# EAGLE schematic pcbqr (EAGLE 5.11)

## Sheet 1 of 3
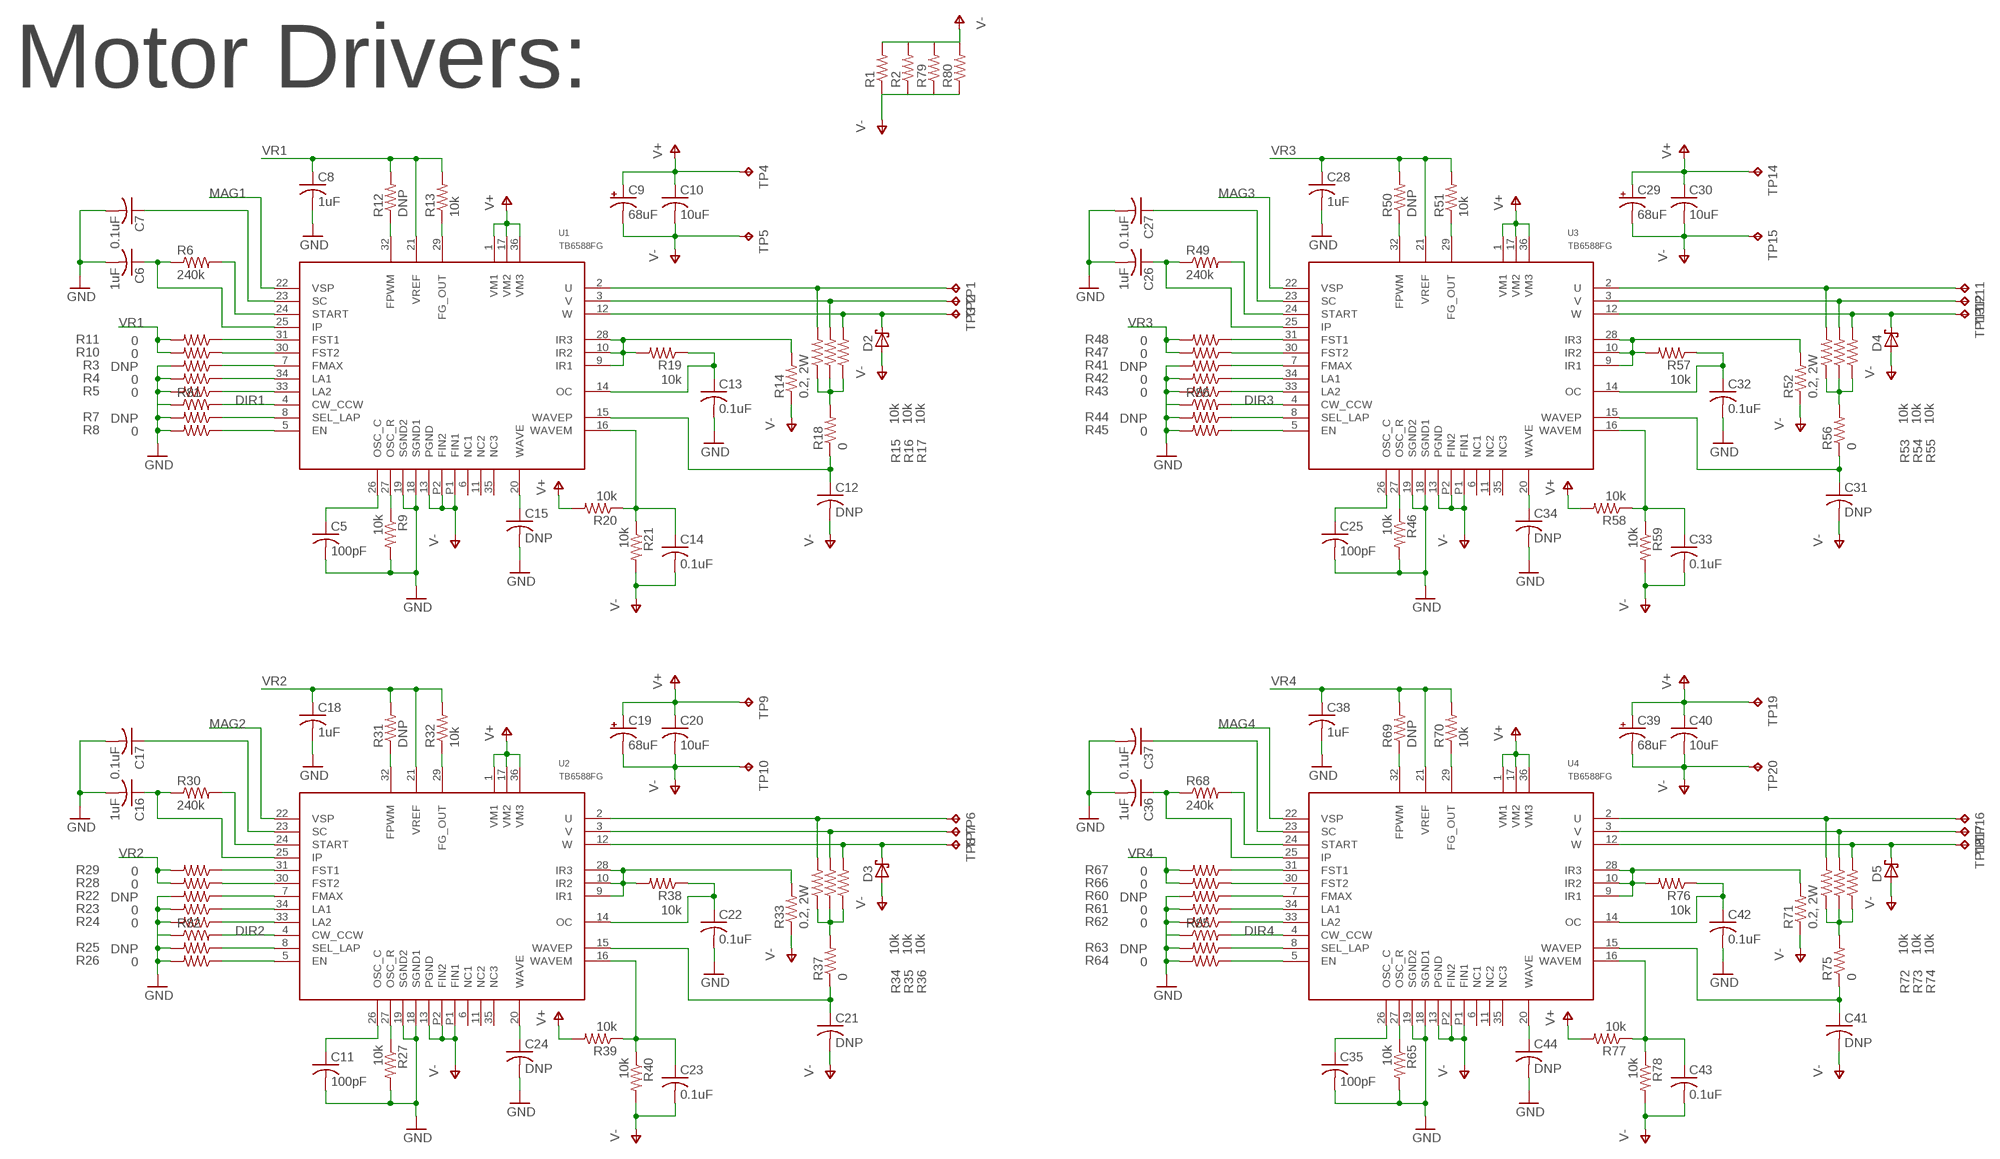
[diagram p0: schematic, sheet 1]

### Parts
C5  100pF  C-USC0603  [C0603]
C6  1uF  C-USC0603  [C0603]
C7  0.1uF  C-USC0603  [C0603]
C8  1uF  C-USC0603  [C0603]
C9  68uF  CPOL-USD  [PANASONIC_D]
C10  10uF  C-USC1206  [C1206]
C11  100pF  C-USC0603  [C0603]
C12  DNP  C-USC0603  [C0603]
C13  0.1uF  C-USC0603  [C0603]
C14  0.1uF  C-USC0603  [C0603]
C15  DNP  C-USC0603  [C0603]
C16  1uF  C-USC0603  [C0603]
C17  0.1uF  C-USC0603  [C0603]
C18  1uF  C-USC0603  [C0603]
C19  68uF  CPOL-USD  [PANASONIC_D]
C20  10uF  C-USC1206  [C1206]
C21  DNP  C-USC0603  [C0603]
C22  0.1uF  C-USC0603  [C0603]
C23  0.1uF  C-USC0603  [C0603]
C24  DNP  C-USC0603  [C0603]
C25  100pF  C-USC0603  [C0603]
C26  1uF  C-USC0603  [C0603]
C27  0.1uF  C-USC0603  [C0603]
C28  1uF  C-USC0603  [C0603]
C29  68uF  CPOL-USD  [PANASONIC_D]
C30  10uF  C-USC1206  [C1206]
C31  DNP  C-USC0603  [C0603]
C32  0.1uF  C-USC0603  [C0603]
C33  0.1uF  C-USC0603  [C0603]
C34  DNP  C-USC0603  [C0603]
C35  100pF  C-USC0603  [C0603]
C36  1uF  C-USC0603  [C0603]
C37  0.1uF  C-USC0603  [C0603]
C38  1uF  C-USC0603  [C0603]
C39  68uF  CPOL-USD  [PANASONIC_D]
C40  10uF  C-USC1206  [C1206]
C41  DNP  C-USC0603  [C0603]
C42  0.1uF  C-USC0603  [C0603]
C43  0.1uF  C-USC0603  [C0603]
C44  DNP  C-USC0603  [C0603]
D2  SCHOTTKY_SMA  [SMA]
D3  SCHOTTKY_SMA  [SMA]
D4  SCHOTTKY_SMA  [SMA]
D5  SCHOTTKY_SMA  [SMA]
R1  R-US_M1206  [M1206]
R2  R-US_M1206  [M1206]
R3  DNP  R-US_R0603  [R0603]
R4  0  R-US_R0603  [R0603]
R5  0  R-US_R0603  [R0603]
R6  240k  R-US_R0603  [R0603]
R7  DNP  R-US_R0603  [R0603]
R8  0  R-US_R0603  [R0603]
R9  10k  R-US_R0603  [R0603]
R10  0  R-US_R0603  [R0603]
R11  0  R-US_R0603  [R0603]
R12  DNP  R-US_R0603  [R0603]
R13  10k  R-US_R0603  [R0603]
R14  0.2, 2W  R-US_R2512  [R2512]
R15  10k  R-US_R0603  [R0603]
R16  10k  R-US_R0603  [R0603]
R17  10k  R-US_R0603  [R0603]
R18  0  R-US_R0603  [R0603]
R19  10k  R-US_R0603  [R0603]
R20  10k  R-US_R0603  [R0603]
R21  10k  R-US_R0603  [R0603]
R22  DNP  R-US_R0603  [R0603]
R23  0  R-US_R0603  [R0603]
R24  0  R-US_R0603  [R0603]
R25  DNP  R-US_R0603  [R0603]
R26  0  R-US_R0603  [R0603]
R27  10k  R-US_R0603  [R0603]
R28  0  R-US_R0603  [R0603]
R29  0  R-US_R0603  [R0603]
R30  240k  R-US_R0603  [R0603]
R31  DNP  R-US_R0603  [R0603]
R32  10k  R-US_R0603  [R0603]
R33  0.2, 2W  R-US_R2512  [R2512]
R34  10k  R-US_R0603  [R0603]
R35  10k  R-US_R0603  [R0603]
R36  10k  R-US_R0603  [R0603]
R37  0  R-US_R0603  [R0603]
R38  10k  R-US_R0603  [R0603]
R39  10k  R-US_R0603  [R0603]
R40  10k  R-US_R0603  [R0603]
R41  DNP  R-US_R0603  [R0603]
R42  0  R-US_R0603  [R0603]
R43  0  R-US_R0603  [R0603]
R44  DNP  R-US_R0603  [R0603]
R45  0  R-US_R0603  [R0603]
R46  10k  R-US_R0603  [R0603]
R47  0  R-US_R0603  [R0603]
R48  0  R-US_R0603  [R0603]
R49  240k  R-US_R0603  [R0603]
R50  DNP  R-US_R0603  [R0603]
R51  10k  R-US_R0603  [R0603]
R52  0.2, 2W  R-US_R2512  [R2512]
R53  10k  R-US_R0603  [R0603]
R54  10k  R-US_R0603  [R0603]
R55  10k  R-US_R0603  [R0603]
R56  0  R-US_R0603  [R0603]
R57  10k  R-US_R0603  [R0603]
R58  10k  R-US_R0603  [R0603]
R59  10k  R-US_R0603  [R0603]
R60  DNP  R-US_R0603  [R0603]
R61  0  R-US_R0603  [R0603]
R62  0  R-US_R0603  [R0603]
R63  DNP  R-US_R0603  [R0603]
R64  0  R-US_R0603  [R0603]
R65  10k  R-US_R0603  [R0603]
R66  0  R-US_R0603  [R0603]
R67  0  R-US_R0603  [R0603]
R68  240k  R-US_R0603  [R0603]
R69  DNP  R-US_R0603  [R0603]
R70  10k  R-US_R0603  [R0603]
R71  0.2, 2W  R-US_R2512  [R2512]
R72  10k  R-US_R0603  [R0603]
R73  10k  R-US_R0603  [R0603]
R74  10k  R-US_R0603  [R0603]
R75  0  R-US_R0603  [R0603]
R76  10k  R-US_R0603  [R0603]
R77  10k  R-US_R0603  [R0603]
R78  10k  R-US_R0603  [R0603]
R79  R-US_M1206  [M1206]
R80  R-US_M1206  [M1206]
R81  R-US_R0402  [R0402]
R82  R-US_R0402  [R0402]
R85  R-US_R0402  [R0402]
R86  R-US_R0402  [R0402]
TP1  TPTP20SQ  [TP20SQ]
TP2  TPTP20SQ  [TP20SQ]
TP3  TPTP20SQ  [TP20SQ]
TP4  TPTP20SQ  [TP20SQ]
TP5  TPTP20SQ  [TP20SQ]
TP6  TPTP20SQ  [TP20SQ]
TP7  TPTP20SQ  [TP20SQ]
TP8  TPTP20SQ  [TP20SQ]
TP9  TPTP20SQ  [TP20SQ]
TP10  TPTP20SQ  [TP20SQ]
TP11  TPTP20SQ  [TP20SQ]
TP12  TPTP20SQ  [TP20SQ]
TP13  TPTP20SQ  [TP20SQ]
TP14  TPTP20SQ  [TP20SQ]
TP15  TPTP20SQ  [TP20SQ]
TP16  TPTP20SQ  [TP20SQ]
TP17  TPTP20SQ  [TP20SQ]
TP18  TPTP20SQ  [TP20SQ]
TP19  TPTP20SQ  [TP20SQ]
TP20  TPTP20SQ  [TP20SQ]
U1  TB6588FG  [HSOP36-P-450-0.65]
U2  TB6588FG  [HSOP36-P-450-0.65]
U3  TB6588FG  [HSOP36-P-450-0.65]
U4  TB6588FG  [HSOP36-P-450-0.65]

### Nets
DIR1: R81.2 U1.4(CW_CCW)
DIR2: R82.2 U2.4(CW_CCW)
DIR3: R86.2 U3.4(CW_CCW)
DIR4: R85.2 U4.4(CW_CCW)
GND: C5.2 C6.2 C7.2 C8.2 C11.2 C13.2 C15.2 C16.2 C17.2 C18.2 C22.2 C24.2 C25.2 C26.2 C27.2 C28.2 C32.2 C34.2 C35.2 C36.2 C37.2 C38.2 C42.2 C44.2 R3.2 R4.2 R5.2 R7.2 R8.2 R9.2 R22.2 R23.2 R24.2 R25.2 R26.2 R27.2 R41.2 R42.2 R43.2 R44.2 R45.2 R46.2 R60.2 R61.2 R62.2 R63.2 R64.2 R65.2 R81.1 R82.1 R85.1 R86.1 U1.18(SGND1) U1.19(SGND2) U2.18(SGND1) U2.19(SGND2) U3.18(SGND1) U3.19(SGND2) U4.18(SGND1) U4.19(SGND2) ; also sheet 2,3
MAG1: U1.22(VSP) ; also sheet 2
MAG2: U2.22(VSP) ; also sheet 2
MAG3: U3.22(VSP) ; also sheet 2
MAG4: U4.22(VSP) ; also sheet 2
N$3: R15.1 R16.1 R17.1 R18.2
N$4: R14.2 R19.2 U1.9(IR1) U1.10(IR2) U1.28(IR3)
N$5: R15.2 TP1.TP U1.2(U)
N$6: R16.2 TP2.TP U1.3(V)
N$7: D2.C R17.2 TP3.TP U1.12(W)
N$8: R8.1 U1.5(EN)
N$9: R7.1 U1.8(SEL_LAP)
N$10: R6.2 U1.24(START)
N$11: R5.1 U1.33(LA2)
N$12: R4.1 U1.34(LA1)
N$13: R3.1 U1.7(FMAX)
N$14: C5.1 U1.26(OSC_C)
N$15: R9.1 U1.27(OSC_R)
N$16: R10.1 U1.30(FST2)
N$17: R11.1 U1.31(FST1)
N$18: C6.1 R6.1 U1.25(IP)
N$19: R12.1 U1.32(FPWM)
N$20: C7.1 U1.23(SC)
N$21: R13.1 U1.29(FG_OUT)
N$22: C14.1 R20.1 R21.1 U1.16(WAVEM)
N$23: R33.2 R38.2 U2.9(IR1) U2.10(IR2) U2.28(IR3)
N$24: C12.1 R18.1 U1.15(WAVEP)
N$25: C13.1 R19.1 U1.14(OC)
N$26: C15.1 U1.20(WAVE)
N$27: R34.2 TP6.TP U2.2(U)
N$28: R35.2 TP7.TP U2.3(V)
N$29: D3.C R36.2 TP8.TP U2.12(W)
N$30: R26.1 U2.5(EN)
N$31: R25.1 U2.8(SEL_LAP)
N$32: R24.1 U2.33(LA2)
N$33: R23.1 U2.34(LA1)
N$34: R22.1 U2.7(FMAX)
N$35: C11.1 U2.26(OSC_C)
N$36: R27.1 U2.27(OSC_R)
N$37: R28.1 U2.30(FST2)
N$38: R29.1 U2.31(FST1)
N$39: R30.2 U2.24(START)
N$40: C16.1 R30.1 U2.25(IP)
N$41: C17.1 U2.23(SC)
N$42: R31.1 U2.32(FPWM)
N$43: R32.1 U2.29(FG_OUT)
N$44: R34.1 R35.1 R36.1 R37.2
N$45: C21.1 R37.1 U2.15(WAVEP)
N$46: C22.1 R38.1 U2.14(OC)
N$47: C23.1 R39.1 R40.1 U2.16(WAVEM)
N$48: C24.1 U2.20(WAVE)
N$49: R52.2 R57.2 U3.9(IR1) U3.10(IR2) U3.28(IR3)
N$50: R53.2 TP11.TP U3.2(U)
N$51: R54.2 TP12.TP U3.3(V)
N$52: D4.C R55.2 TP13.TP U3.12(W)
N$53: R45.1 U3.5(EN)
N$54: R44.1 U3.8(SEL_LAP)
N$55: R43.1 U3.33(LA2)
N$56: R42.1 U3.34(LA1)
N$57: R41.1 U3.7(FMAX)
N$58: C25.1 U3.26(OSC_C)
N$59: R46.1 U3.27(OSC_R)
N$60: R47.1 U3.30(FST2)
N$61: R48.1 U3.31(FST1)
N$62: R49.2 U3.24(START)
N$63: C26.1 R49.1 U3.25(IP)
N$64: C27.1 U3.23(SC)
N$65: R50.1 U3.32(FPWM)
N$66: R51.1 U3.29(FG_OUT)
N$67: R53.1 R54.1 R55.1 R56.2
N$68: C31.1 R56.1 U3.15(WAVEP)
N$69: C32.1 R57.1 U3.14(OC)
N$70: C33.1 R58.1 R59.1 U3.16(WAVEM)
N$71: C34.1 U3.20(WAVE)
N$72: R71.2 R76.2 U4.9(IR1) U4.10(IR2) U4.28(IR3)
N$73: R72.2 TP16.TP U4.2(U)
N$74: R73.2 TP17.TP U4.3(V)
N$75: D5.C R74.2 TP18.TP U4.12(W)
N$76: R64.1 U4.5(EN)
N$77: R63.1 U4.8(SEL_LAP)
N$78: R62.1 U4.33(LA2)
N$79: R61.1 U4.34(LA1)
N$80: R60.1 U4.7(FMAX)
N$81: C35.1 U4.26(OSC_C)
N$82: R65.1 U4.27(OSC_R)
N$83: R66.1 U4.30(FST2)
N$84: R67.1 U4.31(FST1)
N$85: R68.2 U4.24(START)
N$86: C36.1 R68.1 U4.25(IP)
N$87: C37.1 U4.23(SC)
N$88: R69.1 U4.32(FPWM)
N$89: R70.1 U4.29(FG_OUT)
N$90: R72.1 R73.1 R74.1 R75.2
N$91: C41.1 R75.1 U4.15(WAVEP)
N$92: C42.1 R76.1 U4.14(OC)
N$93: C43.1 R77.1 R78.1 U4.16(WAVEM)
N$94: C44.1 U4.20(WAVE)
V+: C9.+ C10.1 C19.+ C20.1 C29.+ C30.1 C39.+ C40.1 R20.2 R39.2 R58.2 R77.2 TP4.TP TP9.TP TP14.TP TP19.TP U1.1(VM1) U1.17(VM2) U1.36(VM3) U2.1(VM1) U2.17(VM2) U2.36(VM3) U3.1(VM1) U3.17(VM2) U3.36(VM3) U4.1(VM1) U4.17(VM2) U4.36(VM3) ; also sheet 2
V-: C9.- C10.2 C12.2 C14.2 C19.- C20.2 C21.2 C23.2 C29.- C30.2 C31.2 C33.2 C39.- C40.2 C41.2 C43.2 D2.A D3.A D4.A D5.A R1.1 R1.2 R2.1 R2.2 R14.1 R21.2 R33.1 R40.2 R52.1 R59.2 R71.1 R78.2 R79.1 R79.2 R80.1 R80.2 TP5.TP TP10.TP TP15.TP TP20.TP U1.13(PGND) U1.P1(FIN1) U1.P2(FIN2) U2.13(PGND) U2.P1(FIN1) U2.P2(FIN2) U3.13(PGND) U3.P1(FIN1) U3.P2(FIN2) U4.13(PGND) U4.P1(FIN1) U4.P2(FIN2) ; also sheet 2
VR1: C8.1 R10.2 R11.2 R12.2 R13.2 U1.21(VREF)
VR2: C18.1 R28.2 R29.2 R31.2 R32.2 U2.21(VREF)
VR3: C28.1 R47.2 R48.2 R50.2 R51.2 U3.21(VREF)
VR4: C38.1 R66.2 R67.2 R69.2 R70.2 U4.21(VREF)
Unconnected: U1.6(NC1) U1.11(NC2) U1.35(NC3) U2.6(NC1) U2.11(NC2) U2.35(NC3) U3.6(NC1) U3.11(NC2) U3.35(NC3) U4.6(NC1) U4.11(NC2) U4.35(NC3)

### Notes on the sheet
- Motor Drivers:

## Sheet 2 of 3
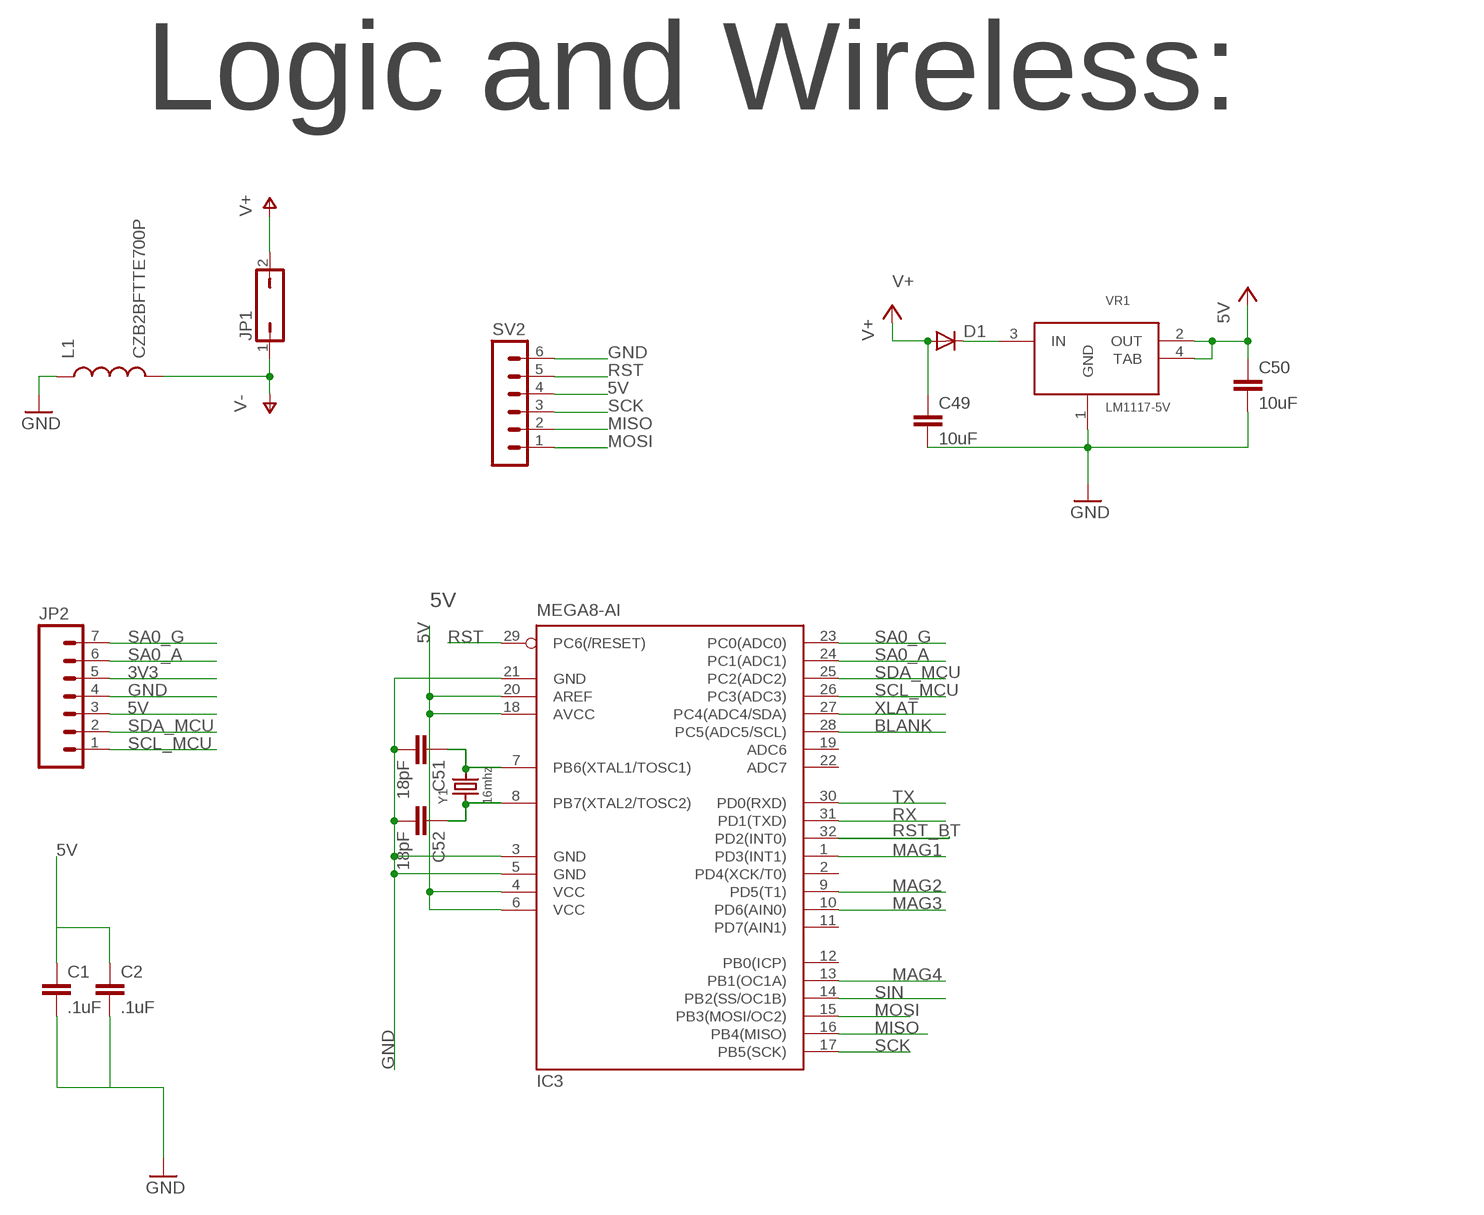
[diagram p1: schematic, sheet 2]

### Parts
C1  .1uF  CAP0805  [0805]
C2  .1uF  CAP0805  [0805]
C49  10uF  CAP0805  [0805]
C50  10uF  CAP0805  [0805]
C51  18pF  CAP0805  [0805]
C52  18pF  CAP0805  [0805]
D1  SPARKFUN_DIODESMA  [SPARKFUN_SMA-DIODE]
IC3  MEGA8-AI  [TQFP32-08]
JP1  JP1Q  [JP1]
JP2  M07  [1X07]
L1  CZB2BFTTE700P  INDUCTOR1206H*  [INDUCTOR-1206]
SV2  MA06-1  [MA06-1]
VR1  LM1117-5V  LM1117  [SOT-223]
Y1  16mhz  CRYSTALTHIN  [CRYSTAL_3.2X2.5]

### Nets
3V3 [power]: JP2.5 ; also sheet 3
5V [power]: C1.1 C2.1 C50.1 IC3.4(VCC) IC3.6(VCC) IC3.18(AVCC) IC3.20(AREF) JP2.3 SV2.4 VR1.2(OUT) VR1.4(TAB)
BLANK: IC3.28(PC5(ADC5/SCL))
GND: C1.2 C2.2 C49.2 C50.2 C51.2 C52.2 IC3.3(GND) IC3.5(GND) IC3.21(GND) JP2.4 L1.P$1 SV2.6 VR1.1(GND) ; also sheet 1,3
MAG1: IC3.1(PD3(INT1)) ; also sheet 1
MAG2: IC3.9(PD5(T1)) ; also sheet 1
MAG3: IC3.10(PD6(AIN0)) ; also sheet 1
MAG4: IC3.13(PB1(OC1A)) ; also sheet 1
MISO: IC3.16(PB4(MISO)) SV2.2
MOSI: IC3.15(PB3(MOSI/OC2)) SV2.1
N$1: D1.C VR1.3(IN)
N$2: C51.1 IC3.7(PB6(XTAL1/TOSC1)) Y1.2
N$95: C52.1 IC3.8(PB7(XTAL2/TOSC2)) Y1.1
RST: IC3.29(PC6(/RESET)) SV2.5
RST_BT: IC3.32(PD2(INT0)) ; also sheet 3
RX: IC3.31(PD1(TXD)) ; also sheet 3
SA0_A: JP2.6
SA0_G: JP2.7
SCK: IC3.17(PB5(SCK)) SV2.3
SCL_MCU: JP2.1
SDA_MCU: JP2.2
SIN: IC3.14(PB2(SS/OC1B))
TX: IC3.30(PD0(RXD)) ; also sheet 3
V+: C49.1 D1.A JP1.2 ; also sheet 1
V-: JP1.1 L1.P$2 ; also sheet 1
XLAT: IC3.27(PC4(ADC4/SDA))
Unconnected: IC3.2(PD4(XCK/T0)) IC3.11(PD7(AIN1)) IC3.12(PB0(ICP)) IC3.19(ADC6) IC3.22(ADC7) IC3.23(PC0(ADC0)) IC3.24(PC1(ADC1)) IC3.25(PC2(ADC2)) IC3.26(PC3(ADC3))

### Notes on the sheet
- Logic and Wireless:

## Sheet 3 of 3
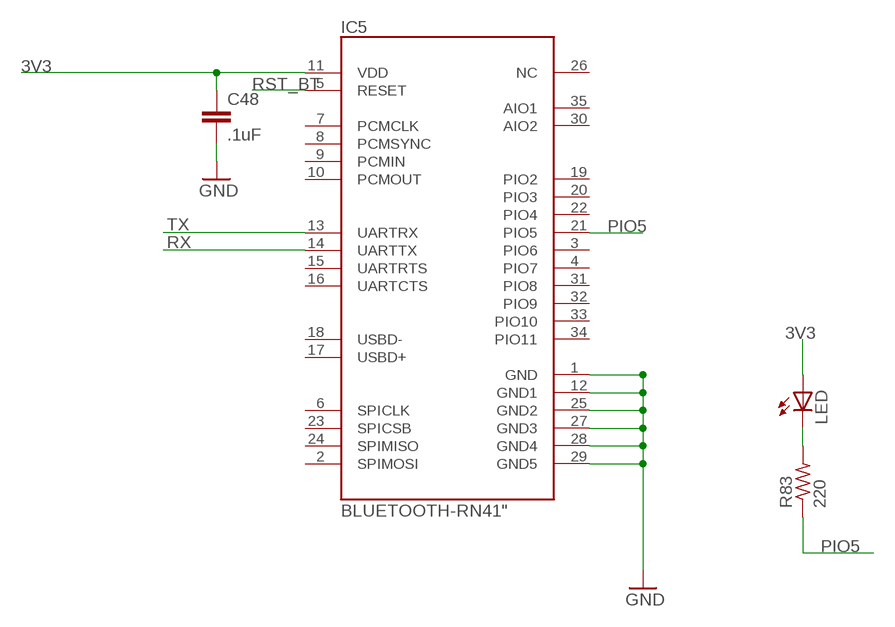
[diagram p2: schematic, sheet 3]

### Parts
C48  .1uF  CAP0805  [0805]
IC5  BLUETOOTH-RN41"  [RN41]
LED  LEDCHIP-LED0603  [CHIP-LED0603]
R83  220  R-US_M0805  [M0805]

### Nets
3V3 [power]: C48.1 IC5.11(VDD) LED.A ; also sheet 2
GND: C48.2 IC5.1(GND) IC5.12(GND1) IC5.25(GND2) IC5.27(GND3) IC5.28(GND4) IC5.29(GND5) ; also sheet 1,2
N$96: LED.C R83.2
PIO5: IC5.21(PIO5) R83.1
RST_BT: IC5.5(RESET) ; also sheet 2
RX: IC5.14(UARTTX) ; also sheet 2
TX: IC5.13(UARTRX) ; also sheet 2
Unconnected: IC5.2(SPIMOSI) IC5.3(PIO6) IC5.4(PIO7) IC5.6(SPICLK) IC5.7(PCMCLK) IC5.8(PCMSYNC) IC5.9(PCMIN) IC5.10(PCMOUT) IC5.15(UARTRTS) IC5.16(UARTCTS) IC5.17(USBD+) IC5.18(USBD-) IC5.19(PIO2) IC5.20(PIO3) IC5.22(PIO4) IC5.23(SPICSB) IC5.24(SPIMISO) IC5.26(NC) IC5.30(AIO2) IC5.31(PIO8) IC5.32(PIO9) IC5.33(PIO10) IC5.34(PIO11) IC5.35(AIO1)

## Library data of the parts
C1 C2 C51 C52 = slice_noshift:CAP: Capacitor Standard 0603 ceramic capacitor, and 0.1" leaded capacitor.
C5-C8 C10-C18 C20-C28 C30-C38 C40-C44 = rcl:C-US: CAPACITOR, American symbol
C9 C19 C29 C39 = rcl:CPOL-US: POLARIZED CAPACITOR, American symbol
C48-C50 = SparkFun:CAP: Capacitor Standard 0603 ceramic capacitor, and 0.1" leaded capacitor.
D1 = avrcanbus:SPARKFUN_DIODE: Diode These are standard reverse protection diodes and small signal diodes. SMA package can handle up to about 1A. SOD-323 can handle about 200mA. What the SOD-323 package when ordering, there are some mfgs out there that are 5-pin packages.
D2-D5 = sc_usercreated:SCHOTTKY_SMA
IC3 = atmel:MEGA8: MICROCONTROLLER 8 Kbytes FLASH, 1 kbytes SRAM, 512 bytes EEPROM, USART, 6-channel 10 bit ADC, 2-channel 8 bit ADC Pin compatible with Atmega48, ATMega88, ATMega168 Source: avr.lbr; MPN: ATMEGA8-16AU; OC_FARNELL: 9171371; OC_NEWARK: 73M8863
IC5 = NSL_Mini_Quad:BLUETOOTH-RN41
JP1 = jumper:JP1Q: JUMPER
JP2 = SparkFun:M07: Header 7 Standard 7-pin 0.1" header. Use with straight break away headers (SKU : PRT-00116), right angle break away headers (PRT-00553), swiss pins (PRT-00743), machine pins (PRT-00117), and female headers (PRT-00115). NOTES ON THE VARIANTS LOCK and LOCK_LONGPADS... This footprint was designed to help hold the alignment of a through-hole component (i.e. 7-pin header) while soldering it into place. You may notice that each hole has been shifted either up or down by 0.005 of an inch from it's more standard position (which is usually a perfectly straight line). This slight alteration caused the pins (the squares in the middle) to touch the edges of the holes. Because they are alternating, it causes a "brace" to hold the header in place. 0.005 has proven to be the perfect amount of "off-center" position when using our standard breakaway headers. Although looks a little odd when you look at the bare footprint, once you have a header in there, the alteration is very hard to notice. Also, if you push a header all the way into place, it is covered up entirely on the bottom side. This idea of altering the position of holes to aid alignment will be further integrated into the Sparkfun Library for other footprints. It can help hold any component with 3 or more connection pins.
L1 = SparkFun:INDUCTOR: Inductors Basic Inductor/Choke - 0603 and 1206. Footprints are not proven and vary greatly between part numbers.
LED = led:LED: LED OSRAM: - CHIPLED LG R971, LG N971, LY N971, LG Q971, LY Q971, LO R971, LY R971 LH N974, LH R974 LS Q976, LO Q976, LY Q976 LO Q996 - Hyper CHIPLED LW Q18S LB Q993, LB Q99A, LB R99A - SideLED LS A670, LO A670, LY A670, LG A670, LP A670 LB A673, LV A673, LT A673, LW A673 LH A674 LY A675 LS A676, LA A676, LO A676, LY A676, LW A676 LS A679, LY A679, LG A679 - Hyper Micro SIDELED® LS Y876, LA Y876, LO Y876, LY Y876 LT Y87S - SmartLED LW L88C, LW L88S LB L89C, LB L89S, LG L890 LS L89K, LO L89K, LY L89K LS L896, LA L896, LO L896, LY L896 - TOPLED LS T670, LO T670, LY T670, LG T670, LP T670 LSG T670, LSP T670, LSY T670, LOP T670, LYG T670 LG T671, LOG T671, LSG T671 LB T673, LV T673, LT T673, LW T673 LH T674 LS T676, LA T676, LO T676, LY T676, LB T676, LH T676, LSB T676, LW T676 LB T67C, LV T67C, LT T67C, LS T67K, LO T67K, LY T67K, LW E67C LS E67B, LA E67B, LO E67B, LY E67B, LB E67C, LV E67C, LT E67C LW T67C LS T679, LY T679, LG T679 LS T770, LO T770, LY T770, LG T770, LP T770 LB T773, LV T773, LT T773, LW T773 LH T774 LS E675, LA E675, LY E675, LS T675 LS T776, LA T776, LO T776, LY T776, LB T776 LHGB T686 LT T68C, LB T68C - Hyper Mini TOPLED® LB M676 - Mini TOPLED Santana® LG M470 LS M47K, LO M47K, LY M47K Source: http://www.osram.convergy.de LUXEON: - LUMILED® LXK2-PW12-R00, LXK2-PW12-S00, LXK2-PW14-U00, LXK2-PW14-V00 LXK2-PM12-R00, LXK2-PM12-S00, LXK2-PM14-U00 LXK2-PE12-Q00, LXK2-PE12-R00, LXK2-PE12-S00, LXK2-PE14-T00, LXK2-PE14-U00 LXK2-PB12-K00, LXK2-PB12-L00, LXK2-PB12-M00, LXK2-PB14-N00, LXK2-PB14-P00, LXK2-PB14-Q00 LXK2-PR12-L00, LXK2-PR12-M00, LXK2-PR14-Q00, LXK2-PR14-R00 LXK2-PD12-Q00, LXK2-PD12-R00, LXK2-PD12-S00 LXK2-PH12-R00, LXK2-PH12-S00 LXK2-PL12-P00, LXK2-PL12-Q00, LXK2-PL12-R00 Source: www.luxeon.com KINGBRIGHT: KA-3528ASYC Source: www.kingbright.com
R1-R83 R85 R86 = rcl:R-US_: RESISTOR, American symbol
SV2 = NSL:MA06-1: PIN HEADER
TP1-TP20 = testpad:TP: Test pad
U1-U4 = sc_usercreated:TB6588FG
VR1 = sc_usercreated:LM1117
Y1 = microbuilder:CRYSTAL: Crystals HC49UP - Surface Mount Crystal 4.0MHz 18pF +/-30ppm Surface Mount Crystal [Digikey: 535-9857-1-ND] 12.0 MHz Surface Mount Crystal [Digikey: 535-9869-6-ND] 25.0 MHz Surface Mount Crystal [Digikey: 535-9078-1-ND] 3.2 x 2.5mm - MEMs SMT Crystal 12.0 MHz 8pF 15ppm 3.2 x 2.5mm Crystal [Digikey: 644-1047-1-ND] 16.0 MHz 8pF 15ppm 3.2 x 2.5mm Crystal [Digikey: 644-1049-1-ND] 16.0 MHz 10pF 10ppm 3.2 x 2.5mm Crystal [Digikey: 644-1100-1-ND] 27.12 MHz 18pF 30ppm 3.2 x 2.5mm Crystal [Digikey: 887-1424-1-ND] 4.9 x 1.8mm - MEMs SMT Crystal 32.768 KHz 12.5pF 20ppm 4.9 x 1.8mm Crystal [Digikey: SE2415CT-ND] Cylinder 32.768KHz Cylinder Crystal

## Net classes
0 default: width 0.203 mm, drill 0.406 mm, clearance 0.203 mm
1 power: width 0.203 mm